# Altium schematic sheet io-matrix.SchDoc
size A3; DocumentNumber: 21; SheetNumber: 21; SheetTotal: 45; SheetDescription: IO Connection Matrix
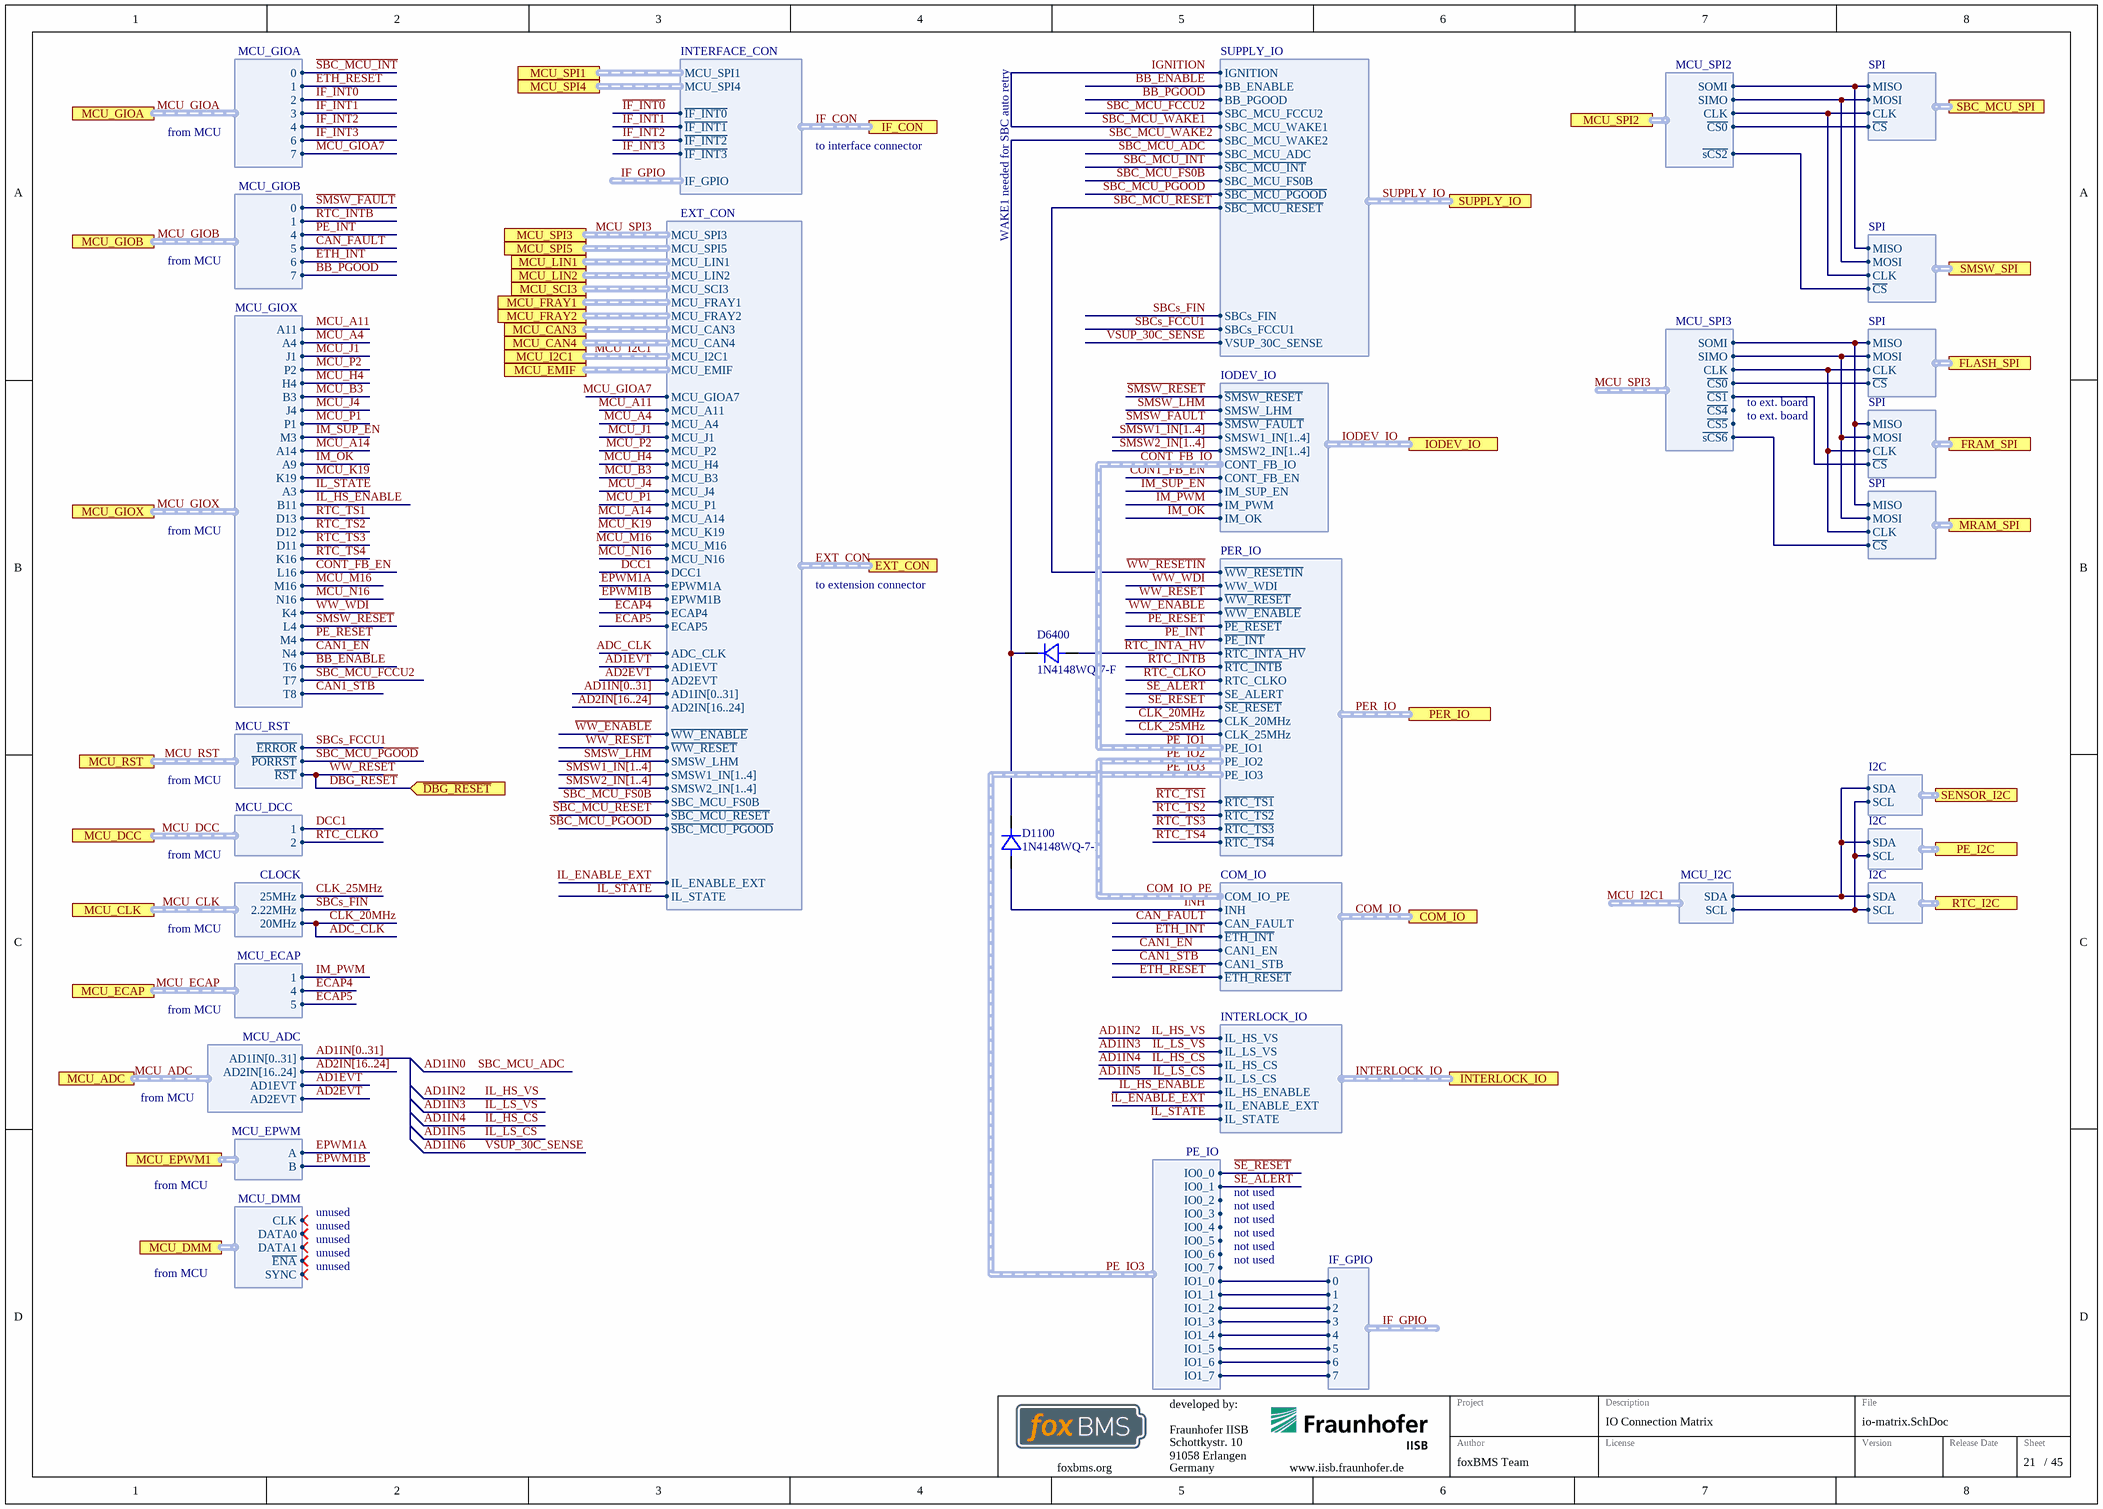
[diagram p0: io-matrix.SchDoc]

## Parts
D1100  1N4148WQ-7-F  [SOD-123_CASE-425-04-ISSUE-G]
D6400  1N4148WQ-7-F  [SOD-123_CASE-425-04-ISSUE-G]

## Ports
COM_IO (harness COM_IO), EXT_CON (harness EXT_CON), FLASH_SPI (harness SPI), FRAM_SPI (harness SPI), IF_CON (harness INTERFACE_CON), INTERLOCK_IO (harness INTERLOCK_IO), IODEV_IO (harness IODEV_IO), MCU_ADC (harness MCU_ADC), MCU_CAN3 (harness MCU_CAN), MCU_CAN4 (harness MCU_CAN), MCU_CLK (harness CLOCK), MCU_DCC (harness MCU_DCC), MCU_DMM (harness MCU_DMM), MCU_ECAP (harness MCU_ECAP), MCU_EMIF (harness MCU_EMIF), MCU_EPWM1 (harness MCU_EPWM), MCU_FRAY1 (harness MCU_FRAY), MCU_FRAY2 (harness MCU_FRAY), MCU_GIOA (harness MCU_GIOA), MCU_GIOB (harness MCU_GIOB), MCU_GIOX (harness MCU_GIOX), MCU_I2C1 (harness MCU_I2C), MCU_LIN1 (harness MCU_LIN), MCU_LIN2 (harness MCU_LIN), MCU_RST (harness MCU_RST), MCU_SCI3 (harness MCU_SCI), MCU_SPI1 (harness MCU_SPI1), MCU_SPI2 (harness MCU_SPI2), MCU_SPI3 (harness MCU_SPI3), MCU_SPI4 (harness MCU_SPI4), MCU_SPI5 (harness MCU_SPI5), MRAM_SPI (harness SPI), PE_I2C (harness I2C), PER_IO (harness PER_IO), RTC_I2C (harness I2C), SBC_MCU_SPI (harness SPI), SENSOR_I2C (harness I2C), SMSW_SPI (harness SPI), SUPPLY_IO (harness SUPPLY_IO), ~{DBG_RESET} (in)

## Harnesses
MCU_GIOX: A11, A4, J1, P2, H4, B3, J4, P1, M3, A14, A9, K19, A3, B11, D13, D12, D11, K16, L16, M16, N16, K4, L4, M4, T6, T7, N4, T8
MCU_SPI2: CLK, SIMO, SOMI, ~{CS0}, ~{sCS2}
MCU_SPI3: CLK, SIMO, SOMI, ~{CS1}, ~{CS4}, ~{CS5}, ~{CS0}, ~{sCS6}
SPI: CLK, MOSI, MISO, ~{CS}
MCU_I2C: SDA, SCL
I2C: SDA, SCL
MCU_GIOA: 0, 2, 3, 4, 6, 7, 1
MCU_RST: ~{ERROR}, ~{PORRST}, ~{RST}
MCU_DCC: 1, 2
MCU_GIOB: 0, 1, 4, 5, 6, 7
CLOCK: 2.22MHz, 20MHz, 25MHz
PE_IO: IO0_0, IO0_1, IO0_2, IO0_3, IO0_4, IO0_5, IO0_6, IO0_7, IO1_0, IO1_1, IO1_2, IO1_3, IO1_4, IO1_5, IO1_6, IO1_7
MCU_ECAP: 1, 4, 5
IODEV_IO: ~{SMSW_RESET}, SMSW_LHM, ~{SMSW_FAULT}, CONT_FB_IO, CONT_FB_EN, IM_SUP_EN, IM_PWM, IM_OK, SMSW1_IN[1..4], SMSW2_IN[1..4]
MCU_ADC: AD2IN[16..24], AD1EVT, AD2EVT, AD1IN[0..31]
SUPPLY_IO: IGNITION, BB_ENABLE, BB_PGOOD, SBC_MCU_FCCU2, SBC_MCU_WAKE1, SBC_MCU_WAKE2, SBC_MCU_ADC, ~{SBC_MCU_INT}, SBC_MCU_FS0B, ~{SBC_MCU_PGOOD}, ~{SBC_MCU_RESET}, SBCs_FIN, SBCs_FCCU1, VSUP_30C_SENSE
COM_IO: COM_IO_PE, CAN_FAULT, ~{ETH_INT}, INH, CAN1_EN, CAN1_STB, ~{ETH_RESET}
PER_IO: WW_WDI, ~{WW_RESET}, ~{WW_ENABLE}, ~{PE_RESET}, ~{PE_INT}, ~{RTC_INTA_HV}, ~{RTC_INTB}, RTC_CLKO, SE_ALERT, ~{SE_RESET}, CLK_20MHz, CLK_25MHz, PE_IO1, PE_IO2, PE_IO3, ~{RTC_TS1}, ~{RTC_TS2}, ~{RTC_TS3}, ~{RTC_TS4}, ~{WW_RESETIN}
INTERLOCK_IO: IL_HS_CS, IL_LS_CS, IL_HS_VS, IL_LS_VS, IL_HS_ENABLE, IL_STATE, IL_ENABLE_EXT
EXT_CON: MCU_SPI3, MCU_SPI5, MCU_LIN1, MCU_LIN2, MCU_FRAY1, MCU_FRAY2, MCU_CAN3, MCU_CAN4, MCU_I2C1, MCU_EMIF, DCC1, EPWM1A, EPWM1B, ECAP4, ECAP5, ADC_CLK, AD1EVT, AD2EVT, AD1IN[0..31], AD2IN[16..24], ~{WW_ENABLE}, ~{WW_RESET}, SMSW_LHM, SMSW1_IN[1..4], SMSW2_IN[1..4], SBC_MCU_FS0B, ~{SBC_MCU_RESET}, ~{SBC_MCU_PGOOD}, IL_ENABLE_EXT, IL_STATE, MCU_GIOA7, MCU_A11, MCU_A4, MCU_J1, MCU_P2, MCU_H4, MCU_B3, MCU_J4, MCU_P1, MCU_A14, MCU_K19, MCU_M16, MCU_N16, MCU_SCI3
IF_GPIO: 0, 1, 2, 3, 4, 5, 6, 7
MCU_EPWM: A, B
MCU_DMM: CLK, DATA0, DATA1, SYNC, ~{ENA}
INTERFACE_CON: MCU_SPI1, MCU_SPI4, ~{IF_INT0}, ~{IF_INT1}, ~{IF_INT2}, ~{IF_INT3}, IF_GPIO

## Nets
~{CAN1_STB}: port MCU_GIOX.T8, port COM_IO.CAN1_STB
~{DBG_RESET}: port ~{DBG_RESET}, port MCU_RST.~{RST}, port PER_IO.~{WW_RESET}, port EXT_CON.~{WW_RESET}  [also labelled ~{WW_RESET}]
~{ETH_INT}: port MCU_GIOB.6, port COM_IO.~{ETH_INT}
~{ETH_RESET}: port MCU_GIOA.1, port COM_IO.~{ETH_RESET}
~{IF_INT0}: port MCU_GIOA.2, port IF_CON.~{IF_INT0}
~{IF_INT1}: port MCU_GIOA.3, port IF_CON.~{IF_INT1}
~{IF_INT2}: port MCU_GIOA.4, port IF_CON.~{IF_INT2}
~{IF_INT3}: port MCU_GIOA.6, port IF_CON.~{IF_INT3}
~{PE_INT}: port MCU_GIOB.4, port PER_IO.~{PE_INT}
~{PE_RESET}: port MCU_GIOX.M4, port PER_IO.~{PE_RESET}
~{RTC_INTA_HV}: D6400.2(A) ; port PER_IO.~{RTC_INTA_HV}
~{RTC_INTB}: port MCU_GIOB.1, port PER_IO.~{RTC_INTB}
~{RTC_TS1}: port MCU_GIOX.D13, port PER_IO.~{RTC_TS1}
~{RTC_TS2}: port MCU_GIOX.D12, port PER_IO.~{RTC_TS2}
~{RTC_TS3}: port MCU_GIOX.D11, port PER_IO.~{RTC_TS3}
~{RTC_TS4}: port MCU_GIOX.K16, port PER_IO.~{RTC_TS4}
~{SBC_MCU_INT}: port MCU_GIOA.0, port SUPPLY_IO.~{SBC_MCU_INT}
~{SBC_MCU_PGOOD}: port MCU_RST.~{PORRST}, port SUPPLY_IO.~{SBC_MCU_PGOOD}, port EXT_CON.~{SBC_MCU_PGOOD}
~{SBC_MCU_RESET}: port SUPPLY_IO.~{SBC_MCU_RESET}, port PER_IO.~{WW_RESETIN}, port EXT_CON.~{SBC_MCU_RESET}  [also labelled ~{WW_RESETIN}]
~{SE_RESET}: harness PE_IO.IO0_0, port PER_IO.~{SE_RESET}
~{SMSW_FAULT}: port MCU_GIOB.0, port IODEV_IO.~{SMSW_FAULT}
~{SMSW_RESET}: port MCU_GIOX.L4, port IODEV_IO.~{SMSW_RESET}
~{WW_ENABLE}: port PER_IO.~{WW_ENABLE}, port EXT_CON.~{WW_ENABLE}
AD1EVT: port MCU_ADC.AD1EVT, port EXT_CON.AD1EVT
AD1IN0: port SUPPLY_IO.SBC_MCU_ADC  [also labelled SBC_MCU_ADC]
AD1IN2: port INTERLOCK_IO.IL_HS_VS  [also labelled IL_HS_VS]
AD1IN3: port INTERLOCK_IO.IL_LS_VS  [also labelled IL_LS_VS]
AD1IN4: port INTERLOCK_IO.IL_HS_CS  [also labelled IL_HS_CS]
AD1IN5: port INTERLOCK_IO.IL_LS_CS  [also labelled IL_LS_CS]
AD1IN6: port SUPPLY_IO.VSUP_30C_SENSE  [also labelled VSUP_30C_SENSE]
AD2EVT: port MCU_ADC.AD2EVT, port EXT_CON.AD2EVT
ADC_CLK: port MCU_CLK.20MHz, port PER_IO.CLK_20MHz, port EXT_CON.ADC_CLK  [also labelled CLK_20MHz]
BB_ENABLE: port MCU_GIOX.T6, port SUPPLY_IO.BB_ENABLE
BB_PGOOD: port MCU_GIOB.7, port SUPPLY_IO.BB_PGOOD
CAN1_EN: port MCU_GIOX.N4, port COM_IO.CAN1_EN
CAN_FAULT: port MCU_GIOB.5, port COM_IO.CAN_FAULT
CLK_25MHz: port MCU_CLK.25MHz, port PER_IO.CLK_25MHz
CONT_FB_EN: port MCU_GIOX.L16, port IODEV_IO.CONT_FB_EN
DCC1: port MCU_DCC.1, port EXT_CON.DCC1
ECAP4: port MCU_ECAP.4, port EXT_CON.ECAP4
ECAP5: port MCU_ECAP.5, port EXT_CON.ECAP5
EPWM1A: port EXT_CON.EPWM1A, port MCU_EPWM1.A
EPWM1B: port EXT_CON.EPWM1B, port MCU_EPWM1.B
IF_GPIO.0: harness PE_IO.IO1_0, harness IF_GPIO.0
IF_GPIO.1: harness PE_IO.IO1_1, harness IF_GPIO.1
IF_GPIO.2: harness PE_IO.IO1_2, harness IF_GPIO.2
IF_GPIO.3: harness PE_IO.IO1_3, harness IF_GPIO.3
IF_GPIO.4: harness PE_IO.IO1_4, harness IF_GPIO.4
IF_GPIO.5: harness PE_IO.IO1_5, harness IF_GPIO.5
IF_GPIO.6: harness PE_IO.IO1_6, harness IF_GPIO.6
IF_GPIO.7: harness PE_IO.IO1_7, harness IF_GPIO.7
IGNITION: port SUPPLY_IO.IGNITION, port SUPPLY_IO.SBC_MCU_WAKE1  [also labelled SBC_MCU_WAKE1]
IL_ENABLE_EXT: port INTERLOCK_IO.IL_ENABLE_EXT, port EXT_CON.IL_ENABLE_EXT  [project net EXT_CON.IL_ENABLE_EXT]
IL_HS_ENABLE: port MCU_GIOX.B11, port INTERLOCK_IO.IL_HS_ENABLE
IL_STATE: port MCU_GIOX.A3, port INTERLOCK_IO.IL_STATE, port EXT_CON.IL_STATE  [project net EXT_CON.IL_STATE]
IM_OK: port MCU_GIOX.A9, port IODEV_IO.IM_OK
IM_PWM: port MCU_ECAP.1, port IODEV_IO.IM_PWM
IM_SUP_EN: port MCU_GIOX.M3, port IODEV_IO.IM_SUP_EN
INH: D1100.2(A) ; port COM_IO.INH  [project net COM_IO.INH]
MCU_A4: port MCU_GIOX.A4, port EXT_CON.MCU_A4  [project net EXT_CON.MCU_A4]
MCU_A11: port MCU_GIOX.A11, port EXT_CON.MCU_A11  [project net EXT_CON.MCU_A11]
MCU_A14: port MCU_GIOX.A14, port EXT_CON.MCU_A14  [project net EXT_CON.MCU_A14]
MCU_B3: port MCU_GIOX.B3, port EXT_CON.MCU_B3  [project net EXT_CON.MCU_B3]
MCU_GIOA7: port MCU_GIOA.7, port EXT_CON.MCU_GIOA7  [project net EXT_CON.MCU_GIOA7]
MCU_H4: port MCU_GIOX.H4, port EXT_CON.MCU_H4  [project net EXT_CON.MCU_H4]
MCU_I2C1.SCL: port MCU_I2C1.SCL, port RTC_I2C.SCL, port PE_I2C.SCL, port SENSOR_I2C.SCL
MCU_I2C1.SDA: port MCU_I2C1.SDA, port RTC_I2C.SDA, port PE_I2C.SDA, port SENSOR_I2C.SDA
MCU_J1: port MCU_GIOX.J1, port EXT_CON.MCU_J1  [project net EXT_CON.MCU_J1]
MCU_J4: port MCU_GIOX.J4, port EXT_CON.MCU_J4  [project net EXT_CON.MCU_J4]
MCU_K19: port MCU_GIOX.K19, port EXT_CON.MCU_K19  [project net EXT_CON.MCU_K19]
MCU_M16: port MCU_GIOX.M16, port EXT_CON.MCU_M16  [project net EXT_CON.MCU_M16]
MCU_N16: port MCU_GIOX.N16, port EXT_CON.MCU_N16  [project net EXT_CON.MCU_N16]
MCU_P1: port MCU_GIOX.P1, port EXT_CON.MCU_P1  [project net EXT_CON.MCU_P1]
MCU_P2: port MCU_GIOX.P2, port EXT_CON.MCU_P2  [project net EXT_CON.MCU_P2]
MCU_SPI3~{.}CS0: port MCU_SPI3.~{CS0}, port FLASH_SPI.~{CS}
MCU_SPI3~{.}CS1: port MCU_SPI3.~{CS1}, port FRAM_SPI.~{CS}
MCU_SPI3~{.}sCS6: port MCU_SPI3.~{sCS6}, port MRAM_SPI.~{CS}
MCU_SPI3.CLK: port MCU_SPI3.CLK, port FLASH_SPI.CLK, port FRAM_SPI.CLK, port MRAM_SPI.CLK
MCU_SPI3.SIMO: port MCU_SPI3.SIMO, port FLASH_SPI.MOSI, port FRAM_SPI.MOSI, port MRAM_SPI.MOSI
MCU_SPI3.SOMI: port MCU_SPI3.SOMI, port FLASH_SPI.MISO, port FRAM_SPI.MISO, port MRAM_SPI.MISO
RTC_CLKO: port MCU_DCC.2, port PER_IO.RTC_CLKO  [project net MCU_DCC.2]
SBC_MCU_FCCU2: port MCU_GIOX.T7, port SUPPLY_IO.SBC_MCU_FCCU2  [project net MCU_GIOX.T7]
SBC_MCU_FS0B: port SUPPLY_IO.SBC_MCU_FS0B, port EXT_CON.SBC_MCU_FS0B  [project net EXT_CON.SBC_MCU_FS0B]
SBC_MCU_WAKE2: D1100.1(K) D6400.1(K) ; port SUPPLY_IO.SBC_MCU_WAKE2
SBCs_FCCU1: port MCU_RST.~{ERROR}, port SUPPLY_IO.SBCs_FCCU1  [project net MCU_RST~{.}ERROR]
SBCs_FIN: port MCU_CLK.2.22MHz, port SUPPLY_IO.SBCs_FIN  [project net MCU_CLK.2.22MHz]
SE_ALERT: harness PE_IO.IO0_1, port PER_IO.SE_ALERT  [project net PE_IO3.IO0_1]
SMSW_LHM: port IODEV_IO.SMSW_LHM, port EXT_CON.SMSW_LHM  [project net EXT_CON.SMSW_LHM]
WW_WDI: port MCU_GIOX.K4, port PER_IO.WW_WDI  [project net MCU_GIOX.K4]
(unnamed): port MCU_SPI2.CLK, port SBC_MCU_SPI.CLK, port SMSW_SPI.CLK
(unnamed): port MCU_SPI2.SIMO, port SBC_MCU_SPI.MOSI, port SMSW_SPI.MOSI
(unnamed): port MCU_SPI2.SOMI, port SBC_MCU_SPI.MISO, port SMSW_SPI.MISO
(unnamed): port MCU_SPI2.~{CS0}, port SBC_MCU_SPI.~{CS}
(unnamed): port MCU_SPI2.~{sCS2}, port SMSW_SPI.~{CS}

## Buses and harness runs
bus AD1IN[0..31]
bus AD2IN[16..24]
bus SMSW1_IN[1..4]
bus SMSW2_IN[1..4]
harness COM_IO = port COM_IO
harness COM_IO_PE = PE_IO2
harness CONT_FB_IO = PE_IO1
harness EXT_CON = port EXT_CON
harness IF_CON = port IF_CON
harness INTERLOCK_IO = port INTERLOCK_IO
harness IODEV_IO = port IODEV_IO
harness MCU_ADC = port MCU_ADC
harness MCU_CLK = port MCU_CLK
harness MCU_DCC = port MCU_DCC
harness MCU_ECAP = port MCU_ECAP
harness MCU_GIOA = port MCU_GIOA
harness MCU_GIOB = port MCU_GIOB
harness MCU_GIOX = port MCU_GIOX
harness MCU_I2C1 = port MCU_I2C1
harness MCU_RST = port MCU_RST
harness MCU_SPI3 = port MCU_SPI3
harness PER_IO = port PER_IO
harness SUPPLY_IO = port SUPPLY_IO

## Notes on the sheet
- from MCU
- to interface connector
- WAKE1 needed for SBC auto retry
- to ext. board
- to extension connector
- unused
- not used
- Fraunhofer IISB
- Schottkystr. 10
- developed by:
- 91058 Erlangen
- Germany
- Author
- Project
- License
- Description
- File
- Version
- Release Date
- Sheet
- foxbms.org <https://foxbms.org>
- www.iisb.fraunhofer.de <https://www.iisb.fraunhofer.de/>
- foxBMS Team
- /

## Library data of the parts
D1100 D6400 = 1N4148WQ-7-F: Diode; Manufacturer: Diodes Inc.; Breakdown Voltage: 100V; Continuous Forward Current: 300mA; PnP Package: SOD123; Automotive Qualified: True; Part Number: 1N4148WQ-7-F; Part Name: 1N4148WQ-7-F; Operating Temperature: -65°C - +150°C; ComponentLink1Description: Datasheet; ComponentLink1URL: https://www.diodes.com/assets/Datasheets/ds30086.pdf; Supplier 1: Digikey; Supplier Part Number 1: 1N4148WQ-7-FDICT-ND; Supplier 2: Farnell; Supplier Part Number 2: 3127171; Supplier 3: Mouser; Supplier Part Number 3: 621-1N4148WQ-7-F